# EAGLE design 20240311-sn76489-ver1 (EAGLE 9.6.2)
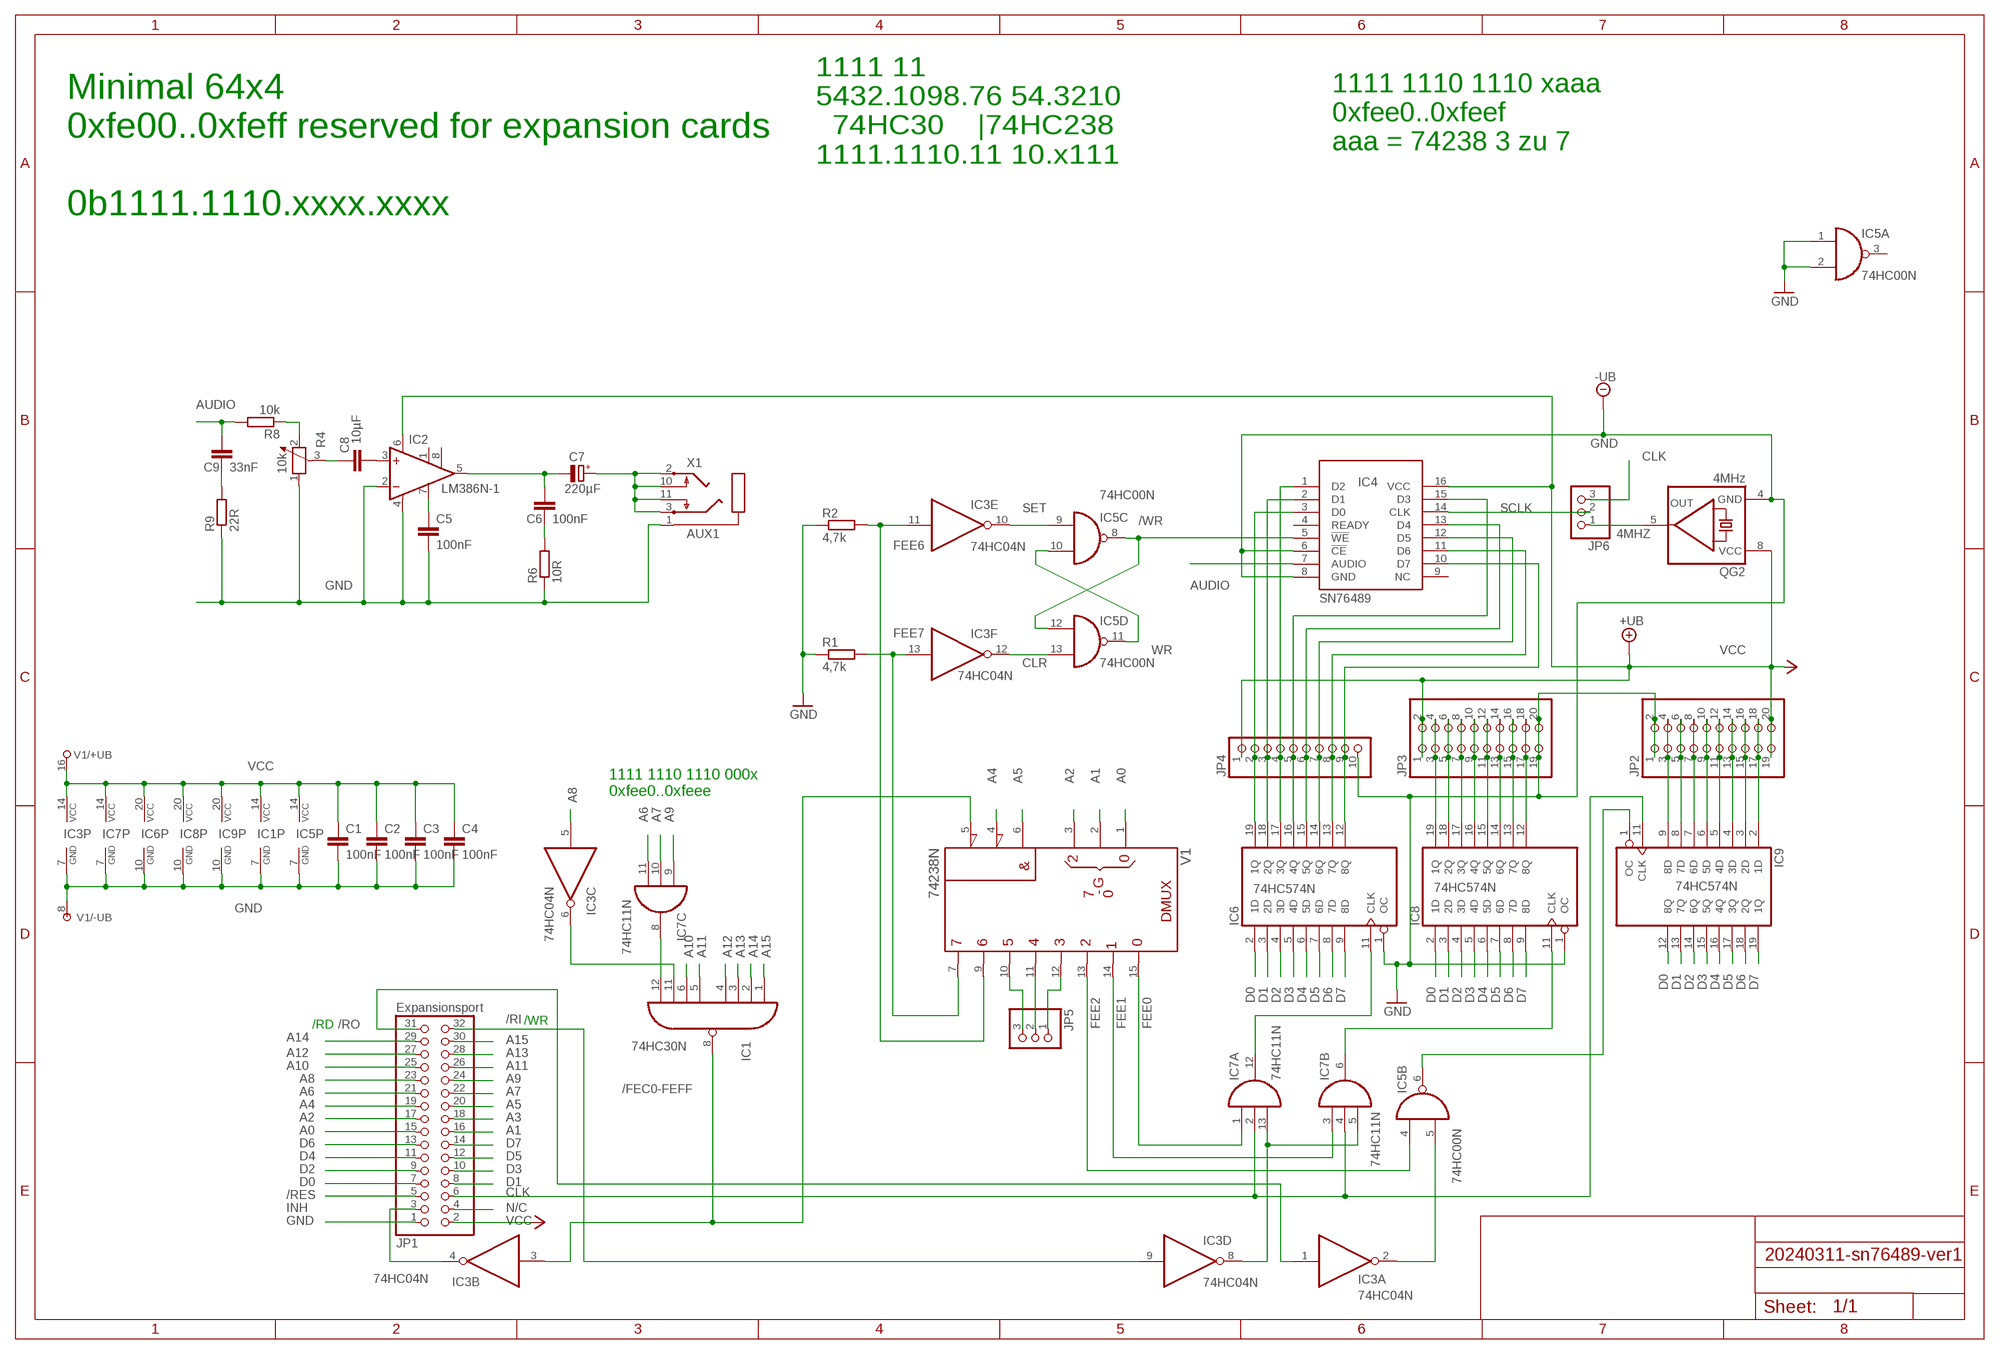
[diagram p0: schematic, sheet 1]

## Parts
C1  100nF  C-EU050-025X075  [C050-025X075]
C2  100nF  C-EU050-025X075  [C050-025X075]
C3  100nF  C-EU050-025X075  [C050-025X075]
C4  100nF  C-EU050-025X075  [C050-025X075]
C5  100nF  C-EU050-025X075  [C050-025X075]
C6  100nF  C-EU050-025X075  [C050-025X075]
C7  220µF  CPOL-EUE2.5-7  [E2,5-7]
C8  10µF  C-EU050-025X075  [C050-025X075]
C9  33nF  C-EU050-025X075  [C050-025X075]
IC1  74HC30N  [DIL14]
IC2  LM386N-1  [DIL08]
IC3  74HC04N  [DIL14]
IC4  SN76489  ALEX-PARTS_SN76489AN  [ALEX-PARTS_DIL16]
IC5  74HC00N  [DIL14]
IC6  74HC574N  [DIL20]
IC7  74HC11N  [DIL14]
IC8  74HC574N  [DIL20]
IC9  74HC574N  [DIL20]
JP1  Expansionsport  PINHD-2X16  [2X16]
JP2  PINHD-2X10  [2X10]
JP3  PINHD-2X10  [2X10]
JP4  PINHD-1X10  [1X10]
JP5  PINHD-1X3  [1X03]
JP6  PINHD-1X3  [1X03]
QG2  4MHz  QG5460  [DIL08S]
R1  4,7k  R-EU_0207/10  [0207/10]
R2  4,7k  R-EU_0207/10  [0207/10]
R4  10k  POTENTIOMETER_PT-10S  [PT-10S]
R6  10R  R-EU_0207/10  [0207/10]
R8  10k  R-EU_0207/10  [0207/10]
R9  22R  R-EU_0207/10  [0207/10]
V1  74238N  [DIL16]
X1  AUX1  CON-SJ1-352XNSJ1-352XN  [SJ1-352XN]

## Nets
4MHZ: JP6.1 QG2.5(OUT)
/FEC0-FEFF: IC1.8(O) IC3.3(B:I) V1.5(!G2B)
/RES: JP1.5
/RI: IC3.9(D:I) JP1.32
/RO: IC3.1(A:I) JP1.31
/WR: IC4.5(!WE) IC5.8(C:O) IC5.12(D:I0)
A0: JP1.15 V1.1(A)
A1: JP1.16 V1.2(B)
A2: JP1.17 V1.3(C)
A3: JP1.18
A4: JP1.19 V1.4(!G2A)
A5: JP1.20 V1.6(G1)
A6: IC7.11(C:I2) JP1.21
A7: IC7.10(C:I1) JP1.22
A8: IC3.5(C:I) JP1.23
A9: IC7.9(C:I0) JP1.24
A10: IC1.6(I5) JP1.25
A11: IC1.5(I4) JP1.26
A12: IC1.4(I3) JP1.27
A13: IC1.3(I2) JP1.28
A14: IC1.2(I1) JP1.29
A15: IC1.1(I0) JP1.30
AUDIO: C9.1 IC4.7(AUDIO) R8.2
AUXOUT: C7.+ X1.2 X1.3 X1.10 X1.11
CLK: IC7.2(A:I1) IC7.4(B:I1) IC9.11(CLK) JP1.6 JP6.3
CLR: IC3.12(F:O) IC5.13(D:I1)
D0: IC6.2(1D) IC8.2(1D) IC9.12(8Q) JP1.7
D1: IC6.3(2D) IC8.3(2D) IC9.13(7Q) JP1.8
D2: IC6.4(3D) IC8.4(3D) IC9.14(6Q) JP1.9
D3: IC6.5(4D) IC8.5(4D) IC9.15(5Q) JP1.10
D4: IC6.6(5D) IC8.6(5D) IC9.16(4Q) JP1.11
D5: IC6.7(6D) IC8.7(6D) IC9.17(3Q) JP1.12
D6: IC6.8(7D) IC8.8(7D) IC9.18(2Q) JP1.13
D7: IC6.9(8D) IC8.9(8D) IC9.19(1Q) JP1.14
FEE0: IC7.1(A:I0) V1.15(Y0)
FEE1: IC7.3(B:I0) V1.14(Y1)
FEE2: IC5.4(B:I0) V1.13(Y2)
FEE3: JP5.1 V1.12(Y3)
FEE4: JP5.2 V1.11(Y4)
FEE5: JP5.3 V1.10(Y5)
FEE6: IC3.11(E:I) R2.2 V1.9(Y6)
FEE7: IC3.13(F:I) R1.2 V1.7(Y7)
GND [Power]: C1.2 C2.2 C3.2 C4.2 C5.2 IC1.7(GND) IC2.2(-IN) IC2.4(GND) IC3.7(P:GND) IC4.6(!CE) IC4.8(GND) IC5.1(A:I0) IC5.2(A:I1) IC5.7(P:GND) IC6.1(OC) IC6.10(GND) IC7.7(P:GND) IC8.1(OC) IC8.10(GND) IC9.10(GND) JP1.1 JP2.1 JP2.2 JP3.19 JP3.20 JP4.10 QG2.4(GND) R1.1 R2.1 R4.1 R6.1 R9.1 V1.8(-UB) X1.1 ; supply symbol labelled -UB
IN0: IC9.9(8D) JP2.3 JP2.4
IN1: IC9.8(7D) JP2.5 JP2.6
IN2: IC9.7(6D) JP2.7 JP2.8
IN3: IC9.6(5D) JP2.9 JP2.10
IN4: IC9.5(4D) JP2.11 JP2.12
IN5: IC9.4(3D) JP2.13 JP2.14
IN6: IC9.3(2D) JP2.15 JP2.16
IN7: IC9.2(1D) JP2.17 JP2.18
INH: IC3.4(B:O) JP1.3
LM5: C6.1 C7.- IC2.5(OUT)
LM7: C5.1 IC2.7(BYPASS)
N$1: IC3.2(A:O) IC5.5(B:I1)
N$3: IC1.12(I7) IC7.8(C:O)
N$18: IC6.11(CLK) IC7.12(A:O)
N$19: IC1.11(I6) IC3.6(C:O)
N$20: IC3.8(D:O) IC7.5(B:I2) IC7.13(A:I2)
N$22: IC7.6(B:O) IC8.11(CLK)
N$24: IC5.6(B:O) IC9.1(OC)
N$45: C6.2 R6.2
N$46: C8.2 IC2.3(+IN)
N$47: C9.2 R9.2
N$49: R4.2 R8.1
N$50: C8.1 R4.3
N/C: JP1.4
OUT0: IC8.19(1Q) JP3.3 JP3.4
OUT1: IC8.18(2Q) JP3.5 JP3.6
OUT2: IC8.17(3Q) JP3.7 JP3.8
OUT3: IC8.16(4Q) JP3.9 JP3.10
OUT4: IC8.15(5Q) JP3.11 JP3.12
OUT5: IC8.14(6Q) JP3.13 JP3.14
OUT6: IC8.13(7Q) JP3.15 JP3.16
OUT7: IC8.12(8Q) JP3.17 JP3.18
SCLK: IC4.14(CLK) JP6.2
SET: IC3.10(E:O) IC5.9(C:I0)
SND0: IC4.3(D0) IC6.19(1Q) JP4.2
SND1: IC4.2(D1) IC6.18(2Q) JP4.3
SND2: IC4.1(D2) IC6.17(3Q) JP4.4
SND3: IC4.15(D3) IC6.16(4Q) JP4.5
SND4: IC4.13(D4) IC6.15(5Q) JP4.6
SND5: IC4.12(D5) IC6.14(6Q) JP4.7
SND6: IC4.11(D6) IC6.13(7Q) JP4.8
SND7: IC4.10(D7) IC6.12(8Q) JP4.9
VCC [Power]: C1.1 C2.1 C3.1 C4.1 IC1.14(VCC) IC2.6(VS) IC3.14(P:VCC) IC4.16(VCC) IC5.14(P:VCC) IC6.20(VCC) IC7.14(P:VCC) IC8.20(VCC) IC9.20(VCC) JP1.2 JP2.19 JP2.20 JP3.1 JP3.2 JP4.1 QG2.8(VCC) V1.16(+UB) ; supply symbol labelled +UB
WR: IC5.10(C:I1) IC5.11(D:O)
Unconnected: IC2.1(GAIN) IC2.8(GAIN) IC4.4(READY) IC4.9(NC) IC5.3(A:O)

## Notes on the sheet
- 1111 1110 1110 xaaa
  0xfee0..0xfeef
  aaa = 74238 3 zu 7
- 1111 11
  5432.1098.76 54.3210
    74HC30    |74HC238
  1111.1110.11 10.x111
- Minimal 64x4
  0xfe00..0xfeff reserved for expansion cards
  
  0b1111.1110.xxxx.xxxx
- 1111 1110 1110 000x
  0xfee0..0xfeee
- /WR
- /RD

## Library data of the parts
C1-C6 C8 C9 = rcl:C-EU: CAPACITOR, European symbol; SPICEPREFIX: C
C7 = rcl:CPOL-EU: POLARIZED CAPACITOR, European symbol; SPICEPREFIX: C
IC1 = 74xx-eu:74*30: 8-input NAND gate
IC2 = linear:LM386?-*: Low Voltage Audio Power Amplifier Source: http://cache.national.com/ds/LM/LM386.pdf
IC3 = 74xx-eu:74*04: Hex INVERTER
IC4 = squareinator2:ALEX-PARTS_SN76489AN: TI SN76489AN Sound Generator
IC5 = 74xx-eu:74*00: Quad 2-input NAND gate
IC6 IC8 IC9 = 74xx-eu:74*574: 8-bit D type FLIP FLOP bus driver
IC7 = 74xx-eu:74*11: Triple 3-input AND gate
JP1 = pinhead:PINHD-2X16: PIN HEADER
JP2 JP3 = pinhead:PINHD-2X10: PIN HEADER
JP4 = pinhead:PINHD-1X10: PIN HEADER
JP5 JP6 = pinhead:PINHD-1X3: PIN HEADER
QG2 = crystal:QG5460: CRYSTAL RESONATOR; OC_FARNELL: unknown; OC_NEWARK: unknown
R1 R2 R6 R8 R9 = rcl:R-EU_: RESISTOR, European symbol; SPICEPREFIX: R
R4 = rcl:POTENTIOMETER_: Potentiometer; SPICEMODEL: POT; SPICEPREFIX: X
V1 = 74ttl-din:74*238: 1 of 8 noninverting DECODER/DEMULTIPLEXER
X1 = con-sj1-352xn:CON-SJ1-352XN: MIC/HEADPHONE JACK KS-S stereo microphone/headphone jack SJ1-352XN (CUD Devices)

## Net classes
0 default: width 0.254 mm
1 Power: width 0.457 mm

## Board
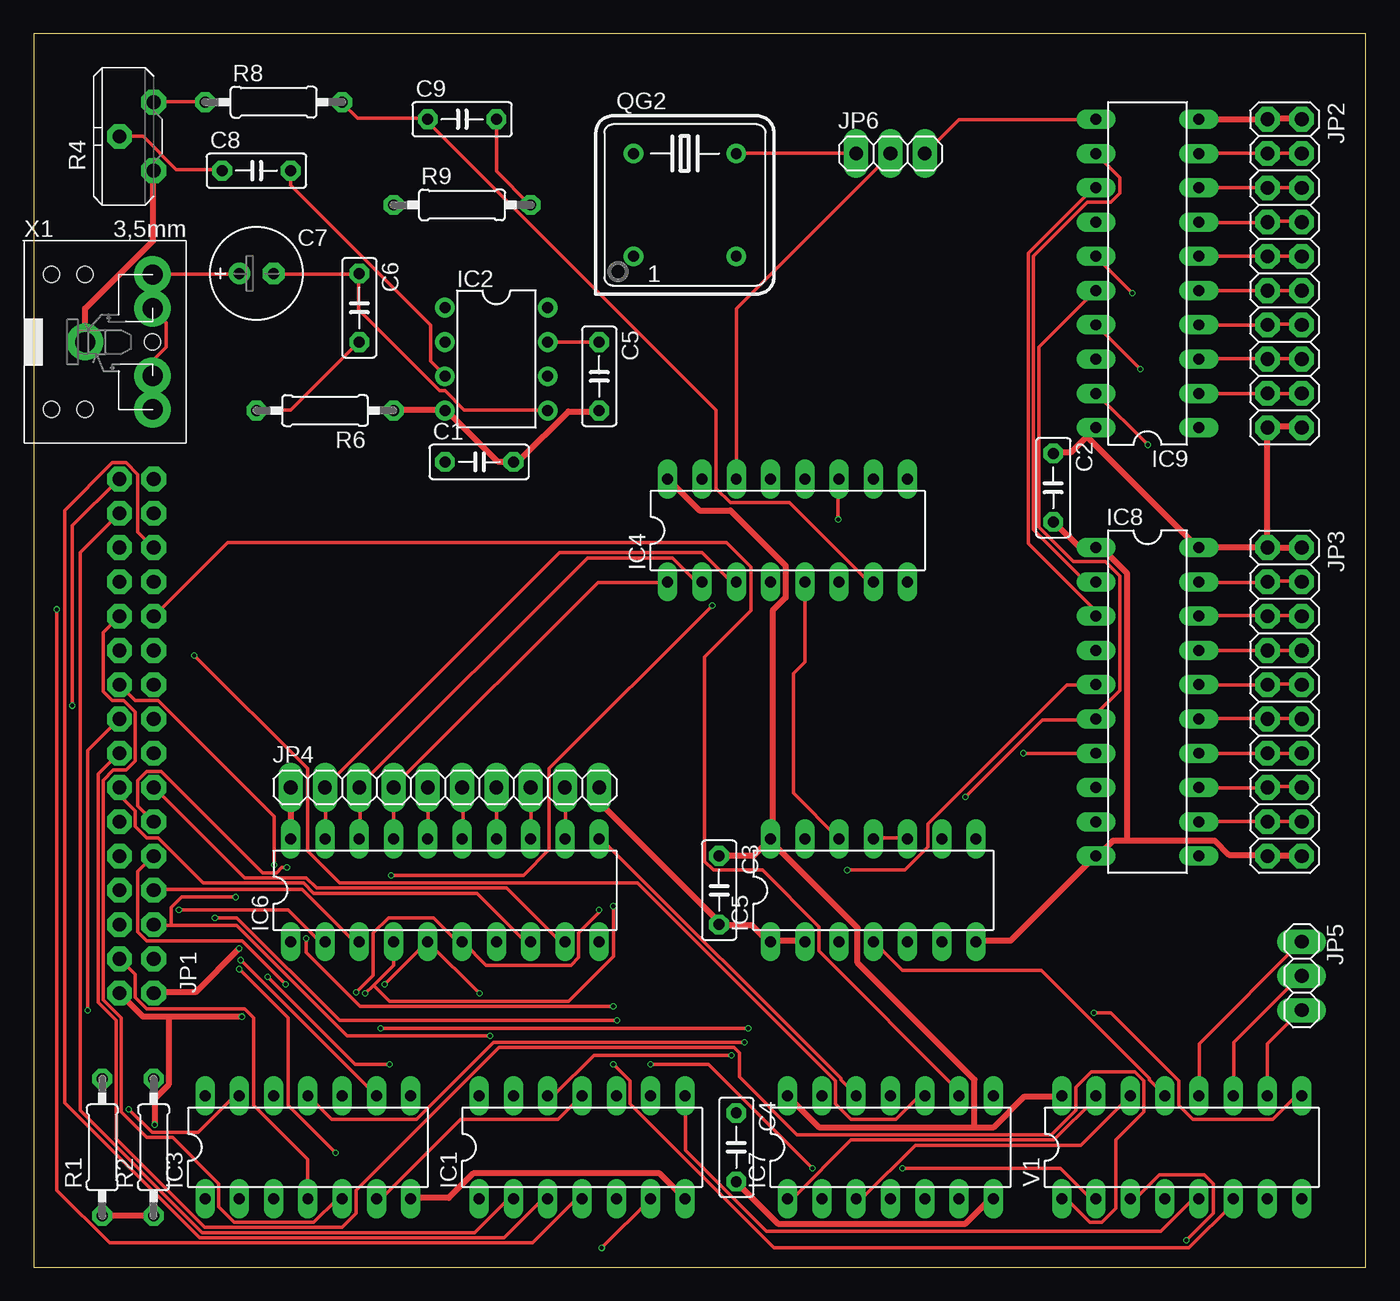
[diagram p1: board, top side]
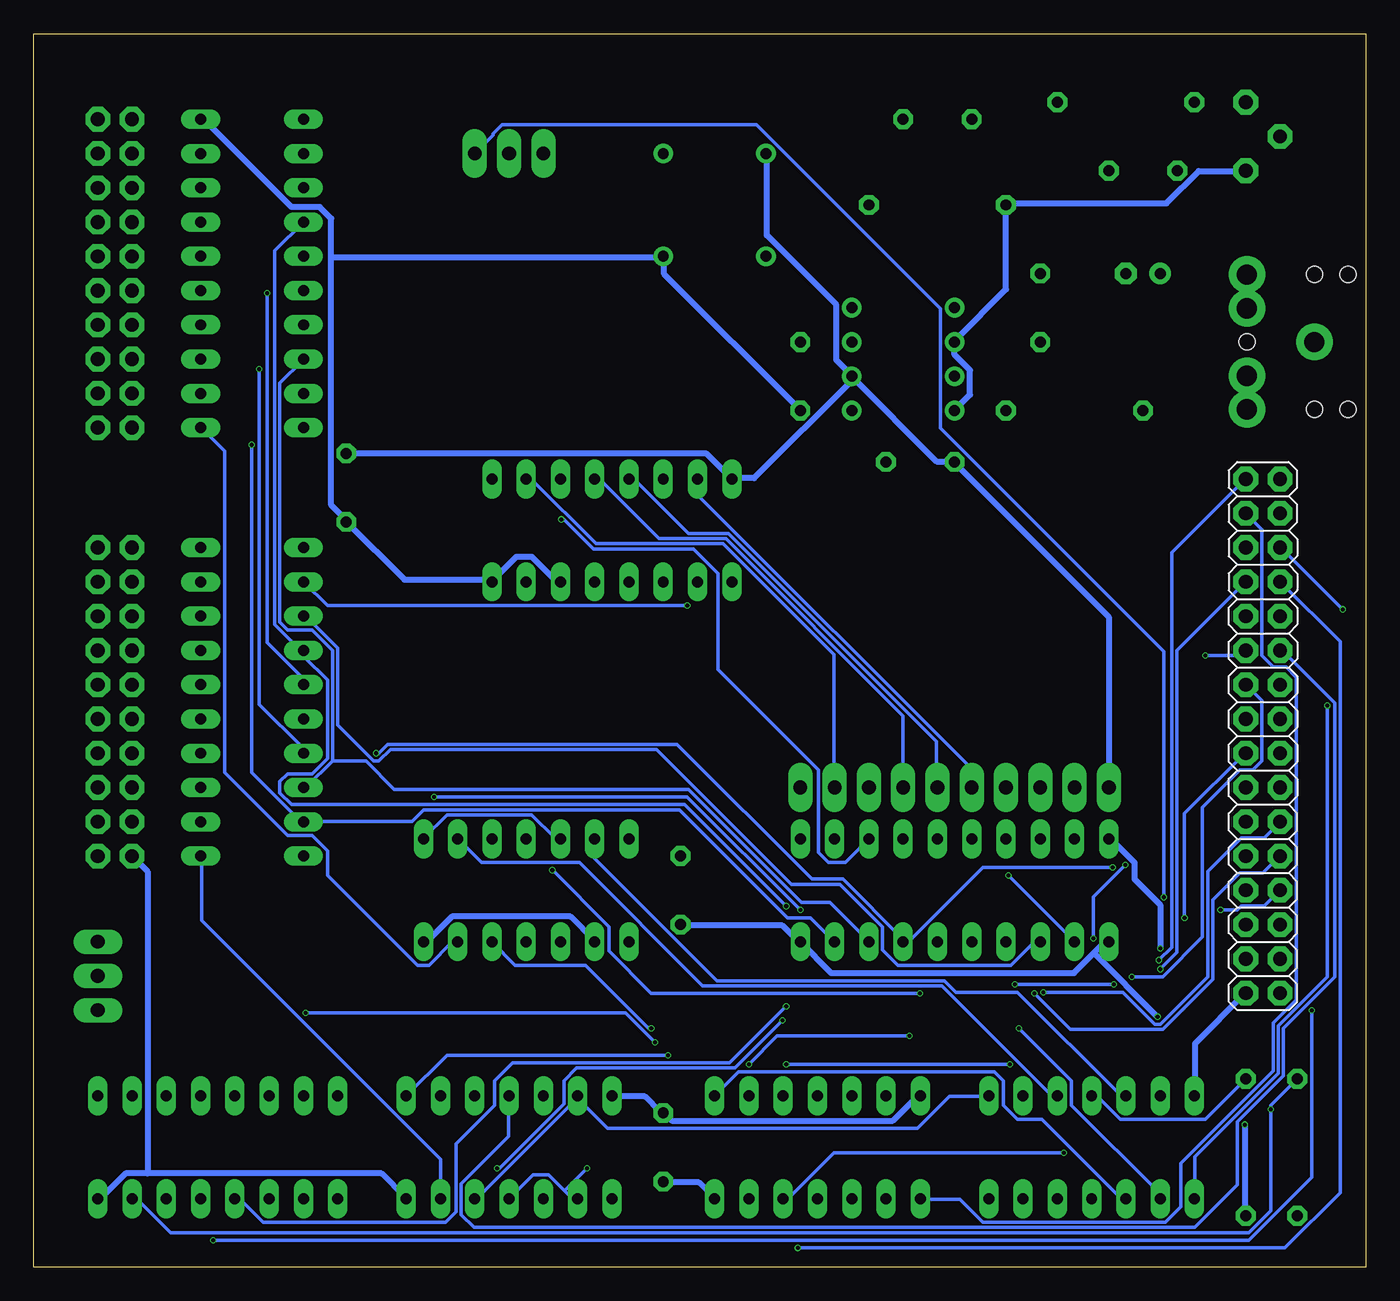
[diagram p2: board, bottom side, seen from below]

Size 98.73 x 91.43 mm. Coordinates in mm from the lower left corner, seen from the top.
Outline: 0,0 98.73,0 98.73,91.43 0,91.43 0,0
Copper layers (1*16): Top 0.035mm / dielectric 1.6mm / Bottom 0.035mm
Design rules "jlcpcb-2layers": minimum track width 5mil, minimum drill 0.3mm, track to track 5mil, track to pad 5mil, pad to pad 5mil, via to via 5mil, smd to smd 5mil, copper to edge 0.2mm, drill to drill 6mil, minimum pad ring 10mil, minimum via ring 3mil, stop-mask expansion 4mil, vias tented up to drill 0mil, thermal gap 10mil

### Footprints (pad centres in the part's own frame; a part is rotated, then mirrored left to right if it is on the bottom)
C050-025X075 = drill 0.813 octagon: 1 -2.54,0; 2 2.54,0
E2,5-7 = drill 0.813 pad 1.6: + -1.27,0 | drill 0.813 pad 1.6 octagon: - 1.27,0
DIL14 = drill 0.813 long: 1 -7.62,-3.81; 2 -5.08,-3.81; 3 -2.54,-3.81; 4 0,-3.81; 5 2.54,-3.81; 6 5.08,-3.81; 7 7.62,-3.81; 8 7.62,3.81; 9 5.08,3.81; 10 2.54,3.81; 11 0,3.81; 12 -2.54,3.81; 13 -5.08,3.81; 14 -7.62,3.81
DIL08 = drill 0.813 pad 1.27: 1 -3.81,-3.81; 2 -1.27,-3.81; 3 1.27,-3.81; 4 3.81,-3.81; 5 3.81,3.81; 6 1.27,3.81; 7 -1.27,3.81; 8 -3.81,3.81
ALEX-PARTS_DIL16 = drill 0.813 long: 1 -8.89,-3.81; 2 -6.35,-3.81; 3 -3.81,-3.81; 4 -1.27,-3.81; 5 1.27,-3.81; 6 3.81,-3.81; 7 6.35,-3.81; 8 8.89,-3.81; 9 8.89,3.81; 10 6.35,3.81; 11 3.81,3.81; 12 1.27,3.81; 13 -1.27,3.81; 14 -3.81,3.81; 15 -6.35,3.81; 16 -8.89,3.81
DIL20 = drill 0.813 long: 1 -11.43,-3.81; 2 -8.89,-3.81; 3 -6.35,-3.81; 4 -3.81,-3.81; 5 -1.27,-3.81; 6 1.27,-3.81; 7 3.81,-3.81; 8 6.35,-3.81; 9 8.89,-3.81; 10 11.43,-3.81; 11 11.43,3.81; 12 8.89,3.81; 13 6.35,3.81; 14 3.81,3.81; 15 1.27,3.81; 16 -1.27,3.81; 17 -3.81,3.81; 18 -6.35,3.81; 19 -8.89,3.81; 20 -11.43,3.81
2X16 = drill 1.016 octagon: 1 -19.05,-1.27; 2 -19.05,1.27; 3 -16.51,-1.27; 4 -16.51,1.27; 5 -13.97,-1.27; 6 -13.97,1.27; 7 -11.43,-1.27; 8 -11.43,1.27; 9 -8.89,-1.27; 10 -8.89,1.27; 11 -6.35,-1.27; 12 -6.35,1.27; 13 -3.81,-1.27; 14 -3.81,1.27; 15 -1.27,-1.27; 16 -1.27,1.27; 17 1.27,-1.27; 18 1.27,1.27; 19 3.81,-1.27; 20 3.81,1.27; 21 6.35,-1.27; 22 6.35,1.27; 23 8.89,-1.27; 24 8.89,1.27; 25 11.43,-1.27; 26 11.43,1.27; 27 13.97,-1.27; 28 13.97,1.27; 29 16.51,-1.27; 30 16.51,1.27; 31 19.05,-1.27; 32 19.05,1.27
2X10 = drill 1.016 octagon: 1 -11.43,-1.27; 2 -11.43,1.27; 3 -8.89,-1.27; 4 -8.89,1.27; 5 -6.35,-1.27; 6 -6.35,1.27; 7 -3.81,-1.27; 8 -3.81,1.27; 9 -1.27,-1.27; 10 -1.27,1.27; 11 1.27,-1.27; 12 1.27,1.27; 13 3.81,-1.27; 14 3.81,1.27; 15 6.35,-1.27; 16 6.35,1.27; 17 8.89,-1.27; 18 8.89,1.27; 19 11.43,-1.27; 20 11.43,1.27
1X10 = drill 1.016 long: 1 -11.43,0; 2 -8.89,0; 3 -6.35,0; 4 -3.81,0; 5 -1.27,0; 6 1.27,0; 7 3.81,0; 8 6.35,0; 9 8.89,0; 10 11.43,0
1X03 = drill 1.016 long: 1 -2.54,0; 2 0,0; 3 2.54,0
DIL08S = drill 0.813: 1 -3.81,-3.81; 4 3.81,-3.81; 5 3.81,3.81; 8 -3.81,3.81
0207/10 = drill 0.813 octagon: 1 -5.08,0; 2 5.08,0
PT-10S = drill 1.016 pad 1.778 octagon: 1 -2.54,-1.27; 2 2.54,-1.27; 3 0,1.27
DIL16 = drill 0.813 long: 1 -8.89,-3.81; 2 -6.35,-3.81; 3 -3.81,-3.81; 4 -1.27,-3.81; 5 1.27,-3.81; 6 3.81,-3.81; 7 6.35,-3.81; 8 8.89,-3.81; 9 8.89,3.81; 10 6.35,3.81; 11 3.81,3.81; 12 1.27,3.81; 13 -1.27,3.81; 14 -3.81,3.81; 15 -6.35,3.81; 16 -8.89,3.81
SJ1-352XN = drill 1.5 pad 2.184: 1 0,0; 2 5,-5; 3 5,5; 10 5,-2.5; 11 5,2.5 | hole 1.2: 5,0; 0,5; 0,-5; -2.5,-5; -2.5,5

### Placement (x,y rotation side)
C1  33.02,59.69 0 top
C2  75.56,57.78 270 top
C3  50.8,27.94 270 top
C4  52.07,8.89 270 top
C5  41.91,66.04 270 top
C6  24.13,71.12 270 top
C7  16.51,73.66 0 top
C8  16.51,81.28 0 top
C9  31.75,85.09 0 top
IC1  40.64,8.89 0 top
IC2  34.29,67.31 270 top
IC3  20.32,8.89 0 top
IC4  55.88,54.61 0 top
IC5  62.23,27.94 0 top
IC6  30.48,27.94 0 top
IC7  63.5,8.89 0 top
IC8  82.55,41.91 270 top
IC9  82.55,73.66 90 top
JP1  7.62,39.37 90 bottom
JP2  92.71,73.66 270 top
JP3  92.71,41.91 270 top
JP4  30.48,35.56 0 top
JP5  93.98,21.59 270 top
JP6  63.5,82.55 0 top
QG2  48.26,78.74 0 top
R1  5.08,8.89 90 top
R2  8.89,8.89 90 top
R4  7.62,83.82 90 top
R6  21.59,63.5 180 top
R8  17.78,86.36 0 top
R9  31.75,78.74 0 top
V1  85.09,8.89 0 top
X1  3.81,68.58 0 top

### Tracks (layer width: path | path; a pad name or v marks a point on that pad's centre or on a via)
4MHZ
  Top 0.254: QG2.5 52.1,82.58 60.96,82.58 JP6.1
/FEC0-FEFF
  Top 0.254: V1.5 86.3,5.05 85.92,5.05 83.53,2.67 54.29,2.67 48.29,8.67 48.29,12.67 IC1.8
  Bottom 0.254: IC1.8 46.48,14.48 27.53,14.48 26.86,13.81 26.86,12 25.81,10.95 24,10.95 18.19,5.14 17.81,5.14 IC3.3
/RI  (via drill 0.3)
  Top 0.254: v15.34,22.77 IC3.9
  Bottom 0.254: v15.34,22.77 14.38,23.72 14.38,52.96 8.95,58.39 JP1.32
/RO  (via drill 0.3)
  Top 0.254: v2.86,41.62 2.86,54.96 6.29,58.39 JP1.31
  Bottom 0.254: v2.86,41.62 2.86,21.53 6.48,17.91 6.48,14.38 12.67,8.19 12.67,5.14 IC3.1
/WR
  Top 0.254: IC4.5 57.15,44.86 56.29,44.01 56.29,35.15 IC5.12
  Bottom 0.254: IC5.12 59.72,31.81 60.1,31.81 61.82,33.53 68.1,33.53 69.82,31.81 IC5.8
A0
  Top 0.254: V1.1 76.2,5.05 76.58,5.05 78.3,3.33 79.15,3.33 80.2,4.38 80.2,9.43 82.3,11.53 82.3,13.81 81.63,14.48 78.39,14.48 77.25,13.34 77.25,11.62 75.44,9.81 56.58,9.81 52.29,14.1 52.29,15.91 51.91,16.29 34.48,16.29 23.91,5.71 23.91,4 22.86,2.95 12.67,2.95 6.1,9.53 6.1,18.29 4.76,19.62 4.76,36.58 6.29,38.1 JP1.15
A1  (via drill 0.3)
  Top 0.254: v64.39,7.33 76.11,7.33 78.3,5.14 78.68,5.14 V1.2 | v43.24,18.29 22.67,18.29 15.05,25.91 v13.43,25.91
  Bottom 0.254: v64.39,7.33 64.2,7.33 59.44,12.1 59.44,13.81 58.48,14.76 46.77,14.76 v43.24,18.29 | v13.43,25.91 13.43,33.62 8.95,38.1 JP1.16
A2  (via drill 0.3)
  Top 0.254: v85.44,2 87.44,4 87.44,6.19 86.77,6.86 83.44,6.86 81.72,5.14 81.34,5.14 V1.3 | v4,19.05 4,38.29 JP1.17
  Bottom 0.254: v85.44,2 8.67,2 4,6.67 v4,19.05
A4  (via drill 0.3)
  Top 0.254: v42.96,19.34 24.19,19.34 20.19,23.34 v20.19,24.38 | v17.81,29.81 17.81,33.43 9.24,42.01 7.53,42.01 JP1.19
  Bottom 0.254: v42.96,19.34 47.15,15.14 63.25,15.14 64.58,13.81 64.58,12 67.44,9.14 67.44,4.1 68.2,3.33 81.72,3.33 83.44,5.05 83.82,5.05 V1.4 | v20.19,24.38 20.19,27.43 v17.81,29.81
A5  (via drill 0.3)
  Top 0.254: v42.96,15.05 44.2,13.81 44.2,12.1 54.86,1.43 85.63,1.43 88.87,4.67 88.87,5.05 V1.6 | v26.38,15.05 23.81,15.05 v17.34,21.53
  Bottom 0.254: v26.38,15.05 v42.96,15.05 | v17.34,21.53 15.05,21.53 12.1,24.48 12.1,34.1 9.34,36.86 8.38,36.86 7.71,37.53 7.71,42.01 JP1.20
A6
  Bottom 0.254: JP1.21 6.19,45.72 2.29,41.81 2.29,21.53 6.1,17.72 6.1,14.19 9.53,10.76 9.53,6.1 12.67,2.95 66.1,2.95 67.06,3.9 67.06,6.19 63.53,9.72 63.53,12.67 IC7.11
A7  (via drill 0.3)
  Top 0.254: v11.91,45.34 20.29,36.96 20.29,30.86 22.67,28.48 44.77,28.48 59.44,13.81 59.44,12.1 60.58,10.95 63.91,10.95 65.63,12.67 66.01,12.67 IC7.10
  Bottom 0.254: v11.91,45.34 9.34,45.34 8.95,45.72 JP1.22
A8
  Top 0.254: JP1.23 5.14,47.05 5.14,42.67 5.81,42.01 6.67,42.01 7.53,41.15 7.53,37.53 6.86,36.86 5.91,36.86 5.14,36.1 5.14,19.81 6.48,18.48 6.48,11.53 8.38,9.62 10.29,9.62 13.72,6.19 13.72,4.48 14.86,3.33 20.77,3.33 22.48,5.05 22.86,5.05 IC3.5
A9
  Top 0.254: IC7.9 68.58,13.05 58.2,23.43 58.2,25.24 54.01,29.43 50.39,29.43 49.72,30.1 49.72,45.24 53.15,48.67 53.15,51.91 51.34,53.72 14.38,53.72 8.95,48.29 JP1.24
A10  (via drill 0.3)
  Top 0.254: v42.1,1.43 45.72,5.05 IC1.6
  Bottom 0.254: v42.1,1.43 6,1.43 1.91,5.52 1.91,46.39 6.29,50.77 JP1.25
A11  (via drill 0.3)
  Top 0.254: v22.38,8.48 18.86,12 18.86,18.48 v15.24,22.1
  Bottom 0.254: v22.38,8.48 39.43,8.48 42.77,5.14 43.15,5.14 IC1.5 | v15.24,22.1 14,23.34 14,45.72 8.95,50.77 JP1.26
A12  (via drill 0.3)
  Top 0.254: v1.71,48.77 1.71,5.71 5.62,1.81 36.96,1.81 40.2,5.05 40.58,5.05 IC1.4
  Bottom 0.254: v1.71,48.77 6.29,53.34 JP1.27
A13
  Top 0.254: IC1.3 38.1,5.05 37.72,5.05 34.86,2.19 12.29,2.19 2.29,12.19 2.29,56.1 5.81,59.63 6.86,59.63 7.71,58.77 7.71,54.48 8.86,53.34 JP1.28
A14
  Top 0.254: JP1.29 3.43,52.96 3.43,11.62 12.48,2.57 32.67,2.57 35.15,5.05 35.53,5.05 IC1.2
A15
  Bottom 0.254: IC1.1 32.96,5.05 30.1,5.05 28.38,3.33 14.86,3.33 13.72,4.48 13.72,7.71 6.86,14.57 6.86,18.1 5.14,19.81 5.14,43.72 5.91,44.48 6.86,44.48 7.71,45.34 7.71,54.67 8.86,55.82 JP1.30
AUDIO
  Top 0.254: R8.2 22.86,86.3 24,85.15 29.15,85.15 C9.1 29.05,85.06 50.58,63.53 50.58,57.72 51.63,56.67 56.01,56.67 61.82,50.86 62.2,50.86 IC4.7
AUXOUT
  Top 0.254: X1.2 8.86,63.63 8.86,66.01 X1.10 8.86,66.2 8.86,67.25 9.81,68.2 9.81,70.01 8.86,70.96 X1.11 8.86,71.15 8.86,73.53 X1.3 8.86,73.63 15.24,73.63 C7.+
CLK  (via drill 0.3)
  Top 0.254: IC9.11 78.68,85.06 68.58,85.06 66.1,82.58 JP6.3 | 10.19,25.34 15.05,25.34 23.24,17.14 v33.81,17.14 | 10.19,25.34 8.95,25.34 JP1.6 | v45.72,15.05 50.01,15.05 v57.72,7.33 | v14.95,27.43 10.95,27.43 10.19,26.67 10.19,25.34
  Bottom 0.254: 59.39,5.67 60.58,6.86 61.72,6.86 IC7.4 | 59.39,5.67 58.86,5.14 58.48,5.14 IC7.2 | v33.81,17.14 43.62,17.14 v45.72,15.05 | 59.39,5.67 v57.72,7.33 | JP6.3 64.67,83.92 64.67,84.01 64.01,84.68 45.15,84.68 31.53,71.06 31.53,62.2 14.95,45.62 v14.95,27.43
CLR
  Bottom 0.254: IC5.13 57.15,30.29 48.1,21.24 31.24,21.24 30.39,20.38 25.81,20.38 18.19,12.76 17.81,12.76 IC3.12
D0  (via drill 0.3)
  Top 0.254: v10.76,26.48 18.86,26.48 21.14,24.19 21.53,24.19 IC6.2 | IC8.2 78.68,50.86 77.92,50.86 74.11,54.67 74.11,74.96 78.11,78.96 79.82,78.96 80.49,79.63 80.49,80.77 78.77,82.49 IC9.12 | v26.48,29.05 36.29,29.05 38.2,30.96 38.2,36.96 v50.29,49.05
  Bottom 0.254: v10.76,26.48 9.53,26.48 9.24,26.77 7.53,26.77 JP1.7 | v26.48,29.05 21.62,24.19 IC6.2 | v50.29,49.05 76.96,49.05 78.68,50.77 IC8.2
D1
  Top 0.254: IC6.3 24.1,24.19 23.72,24.19 19.91,28 8.95,28 JP1.8 | IC9.13 78.58,80.01 73.72,75.15 73.72,53.63 78.68,48.67 78.68,48.29 IC8.3
  Bottom 0.254: IC6.3 24.19,24.1 24.57,24.1 26.29,22.38 34.67,22.38 35.81,23.53 35.81,25.24 38.96,28.38 42.58,28.38 52.58,38.39 72.3,38.39 73.15,37.53 73.53,37.53 76.2,40.2 76.2,45.91 78.49,48.2 78.68,48.2 IC8.3
D2  (via drill 0.3)
  Top 0.254: IC6.4 26.67,22.38 25.19,20.91 | v24.57,20.29 25.19,20.91 | v42.96,26.77 42.96,23.05 39.62,19.72 26.38,19.72 25.19,20.91
  Bottom 0.254: IC9.14 80.87,75.34 80.87,47.62 78.96,45.72 IC8.4 78.68,45.62 78.68,45.24 76.96,43.53 76.96,37.72 78.11,36.58 79.92,36.58 80.49,36.01 80.49,35.15 79.63,34.29 50.48,34.29 v42.96,26.77 | v24.57,20.29 21.91,17.62 15.05,17.62 11.34,21.34 11.34,27.24 9.34,29.24 7.62,29.24 6.38,30.48 JP1.9
D3  (via drill 0.3)
  Top 0.254: v26,20.95 29.15,24.1 IC6.5 v33.05,20.29 | v18.67,20.95 15.43,24.19 8.38,24.19 7.71,24.86 7.71,29.34 8.86,30.48 JP1.10 | v81.44,72.2 78.77,74.87 IC9.15 | v60.29,29.43 64.58,29.43 66.29,31.15 66.29,32.86 76.58,43.15 78.68,43.15 IC8.5
  Bottom 0.254: v18.67,20.95 v26,20.95 | v81.44,72.2 81.44,46.29 78.77,43.62 78.77,43.24 IC8.5 | v33.05,20.29 52.96,20.29 56.1,23.43 56.1,25.24 v60.29,29.43
D4  (via drill 0.3)
  Top 0.254: IC9.16 78.68,72.39 74.49,68.2 74.49,54.86 77.06,52.29 79.44,52.29 80.49,51.24 80.49,42.77 78.77,41.05 78.77,40.67 IC8.6 78.68,40.58 74.77,40.58 v69.06,34.86 | v23.91,20.38 25.15,21.62 25.15,24.77 26.29,25.91 29.62,25.91 31.34,24.19 31.72,24.19 IC6.6 31.81,24.1 33.53,22.38 39.81,22.38 40.39,22.95 40.39,24.77 41.91,26.29 v41.91,26.48
  Bottom 0.254: v23.91,20.38 18,20.38 15.62,18 15.24,18 11.72,21.53 11.72,29.34 9.24,31.81 7.53,31.81 6.38,32.96 JP1.11 | v69.06,34.86 50.29,34.86 v41.91,26.48
D5  (via drill 0.3)
  Top 0.254: IC9.17 v82.01,66.58 | v18.76,29.62 18.38,29.62 18,29.24 16.95,29.24 9.43,36.77 8.38,36.77 7.71,36.1 7.71,34.2 JP1.12 | v73.34,38.1 IC8.7
  Bottom 0.254: v82.01,66.58 82.01,41.72 78.77,38.48 78.77,38.1 IC8.7 | v18.76,29.62 28.38,29.62 33.81,24.19 34.29,24.19 IC6.7 34.29,24.29 38.77,28.77 41.05,28.77 51.05,38.77 72.48,38.77 73.15,38.1 v73.34,38.1
D6
  Top 0.254: IC6.8 36.77,24.19 36.39,24.19 32.86,27.72 20.77,27.72 20,28.48 12.57,28.48 9.24,31.81 8.38,31.81 7.53,32.67 7.53,33.81 6.38,34.96 6.38,35.53 JP1.13
  Bottom 0.254: 76.58,37.53 78.49,35.62 78.68,35.62 IC8.8 | 76.58,37.53 76.58,45.72 78.11,47.24 79.92,47.24 80.49,47.82 80.49,65.53 78.77,67.25 IC9.18 | 76.58,37.53 74.11,37.53 72.01,35.43 50.2,35.43 41.81,27.05 39.72,27.05 36.86,24.19 IC6.8
D7  (via drill 0.3)
  Top 0.254: IC6.9 39.34,24.19 38.96,24.19 35.05,28.1 20.95,28.1 20.19,28.86 15.62,28.86 8.95,35.53 JP1.14 | v82.58,60.96 78.77,64.77 IC9.19
  Bottom 0.254: IC6.9 41.15,25.91 42.86,25.91 50.86,33.91 69.82,33.91 70.67,33.05 78.68,33.05 IC8.9 78.77,33.05 78.96,33.05 82.58,36.67 v82.58,60.96
FEE0
  Top 0.254: IC7.1 55.91,5.14 56.29,5.14 60.58,9.43 75.63,9.43 78.68,12.48 78.68,12.67 V1.15
FEE1
  Top 0.254: V1.14 77.63,9.05 65.34,9.05 61.44,5.14 60.96,5.14 IC7.3
FEE2
  Top 0.254: V1.13 83.82,12.76 82.68,13.91 82.68,14 74.68,22 64.39,22 62.29,24.1 IC5.4
FEE3
  Top 0.254: V1.12 86.39,12.76 86.39,16.57 93.92,24.1 JP5.1
FEE4
  Top 0.254: V1.11 88.96,12.76 88.96,16.67 93.92,21.62 JP5.2
FEE5
  Top 0.254: V1.10 91.44,16.57 93.92,19.05 JP5.3
FEE6  (via drill 0.3)
  Top 0.254: v78.58,18.86 79.82,18.86 84.87,13.81 84.87,12 85.92,10.95 91.82,10.95 93.53,12.67 93.92,12.67 V1.9 | v52.67,16.67 34.1,16.67 28.38,10.95 22.1,10.95 20.38,12.67 IC3.11
  Bottom 0.254: R2.2 11.91,10.95 18.19,10.95 19.91,12.67 20.29,12.67 IC3.11 | v78.58,18.86 54.86,18.86 v52.67,16.67
FEE7  (via drill 0.3)
  Top 0.254: v7.05,11.72 8.76,10 12.19,10 14.86,12.67 15.24,12.67 IC3.13
  Bottom 0.254: R1.2 7.05,12 v7.05,11.72 7.05,4.19 8.67,2.57 88.58,2.57 91.06,5.05 91.44,5.05 V1.7
GND  (via drill 0.3)
  Top 0.457: X1.1 3.81,71.06 8.86,76.11 8.86,81.25 R4.1 | R6.1 26.67,63.53 30.48,63.53 IC2.4 30.67,63.44 34.38,59.72 35.53,59.72 C1.2 35.72,59.82 36.01,59.82 39.62,63.44 41.91,63.44 C5.2 | IC9.10 86.39,85.06 91.44,85.06 JP2.1 91.63,85.15 93.92,85.15 JP2.2 | C2.2 75.63,55.24 77.53,53.34 IC8.1 78.96,53.24 79.25,53.24 81.06,51.44 81.06,31.62 | IC1.7 46.39,6.95 32.58,6.95 30.77,5.14 28,5.14 IC3.7 | IC7.7 71.06,5.05 70.87,5.05 69.06,3.24 55.15,3.24 52.1,6.29 C4.2 | JP3.20 JP3.19 91.25,30.57 88.58,30.57 87.53,31.62 81.06,31.62 | IC5.7 69.91,24.19 72.39,24.19 78.68,30.48 IC8.10 78.96,30.57 80.01,31.62 81.06,31.62 | IC5.2 57.15,24.19 54.67,24.19 IC5.1 54.39,24.19 53.24,25.34 50.86,25.34 C3.2 50.77,25.62 41.91,34.48 JP4.10 | R2.1 R1.1 | JP1.1 8.1,18.57 10,18.57 | v15.43,18.57 10,18.57 | v8.95,10.57 8.95,12.48 10,13.53 10,18.57
  Bottom 0.457: IC2.4 30.48,63.53 29.34,64.67 29.34,66.48 30.48,67.63 IC2.2 30.39,68.77 26.67,72.48 R9.1 26.48,78.87 14.76,78.87 12.38,81.25 8.95,81.25 R4.1 | C5.2 41.91,63.53 52.01,73.63 52.01,74.87 QG2.4 52.29,74.87 76.68,74.87 | IC4.6 59.72,50.86 60.01,50.86 61.82,52.67 62.96,52.67 64.77,50.86 IC4.8 64.96,50.96 71.25,50.96 75.53,55.24 C2.2 75.63,55.44 76.68,56.48 76.68,74.87 | 76.68,74.87 76.68,77.72 77.53,78.58 79.63,78.58 86.11,85.06 86.3,85.06 IC9.10 | C4.2 52.01,6.29 49.44,6.29 48.29,5.14 IC1.7 | 90.3,6.95 72.96,6.95 71.15,5.14 IC7.7 | 90.3,6.95 91.92,6.95 93.73,5.14 93.92,5.14 V1.8 | 20.14,23.29 21.62,21.81 39.62,21.81 41.91,24.1 IC6.10 42.1,24.19 43.24,25.34 50.77,25.34 C3.2 | 20.14,23.29 19.34,24.1 19.05,24.1 IC6.1 | 20.14,23.29 v15.43,18.57 | v8.95,10.57 8.95,3.81 R2.1 | IC5.7 69.82,24.19 69.53,24.19 67.72,26 58.96,26 57.15,24.19 IC5.2 | 90.3,6.95 90.3,29.34 JP3.19
IN0
  Top 0.254: IC9.9 86.39,82.58 91.44,82.58 JP2.3 91.53,82.58 93.92,82.58 JP2.4
IN1
  Top 0.254: IC9.8 JP2.5 JP2.6
IN2
  Top 0.254: IC9.7 86.39,77.44 91.44,77.44 JP2.7 91.53,77.53 93.92,77.53 JP2.8
IN3
  Top 0.254: IC9.6 86.39,74.96 91.44,74.96 JP2.9 91.53,74.96 93.92,74.96 JP2.10
IN4
  Top 0.254: IC9.5 JP2.11 JP2.12
IN5
  Top 0.254: IC9.4 86.39,69.82 91.44,69.82 JP2.13 91.53,69.91 93.92,69.91 JP2.14
IN6
  Top 0.254: IC9.3 86.39,67.34 91.44,67.34 JP2.15 91.53,67.34 93.92,67.34 JP2.16
IN7
  Top 0.254: IC9.2 JP2.17 JP2.18
INH
  Top 0.254: IC3.4 20.29,5.14 20.29,8 16.29,12 16.29,18.48 15.62,19.14 8.38,19.14 7.53,20 7.53,21.72 6.38,22.86 JP1.3
LM5
  Top 0.254: C7.- 17.81,73.63 24.1,73.63 C6.1 24.1,73.53 24.1,70.96 30.1,64.96 30.48,64.96 31.91,63.53 38.1,63.53 IC2.5
LM7
  Top 0.254: C5.1 IC2.7
N$1  (via drill 0.3)
  Top 0.254: v52.96,17.72 v25.72,17.72
  Bottom 0.254: IC3.2 15.24,5.43 21.81,12 21.81,13.81 v25.72,17.72 | v52.96,17.72 53.15,17.72 57.82,22.38 63.06,22.38 64.77,24.1 IC5.5
N$3  (via drill 0.3)
  Top 0.254: v51.72,15.72 41.53,15.72 38.58,12.76 38.1,12.76 IC1.12
  Bottom 0.254: v51.72,15.72 68.1,15.72 IC7.8
N$18
  Top 0.254: IC7.12 60.96,12.76 59.82,13.91 59.82,14 42.1,31.72 41.91,31.72 IC6.11
N$19
  Top 0.254: IC3.6 25.43,5.14 25.81,5.14 31.62,10.95 38.86,10.95 40.58,12.67 IC1.11
N$20
  Bottom 0.254: IC7.5 66.01,5.14 65.82,5.14 58.48,12.48 58.48,12.67 IC7.13 58.39,12.48 56.2,10.29 33.24,10.29 30.86,12.67 28,12.67 IC3.8
N$22
  Bottom 0.254: IC7.6 68.58,8 86.3,25.72 86.3,30.48 IC8.11
N$24
  Bottom 0.254: IC5.6 67.34,24.1 67.72,24.1 69.44,22.38 70.29,22.38 76.96,29.05 76.96,30.86 78.11,32 79.92,32 84.58,36.67 84.58,60.48 86.3,62.2 IC9.1
N$45
  Top 0.254: R6.2 16.57,63.53 19.05,63.53 24.1,68.58 C6.2
N$46
  Top 0.254: C8.2 19.05,80.2 29.43,69.82 29.43,67.15 30.48,66.1 IC2.3
N$47
  Top 0.254: C9.2 34.29,81.25 36.77,78.77 R9.2
N$49
  Top 0.254: R8.1 12.67,86.39 8.95,86.39 R4.2
N$50
  Top 0.254: R4.3 8.1,83.82 10.57,81.34 13.91,81.34 C8.1
OUT0
  Top 0.254: IC8.19 86.39,50.77 91.44,50.77 JP3.3 91.53,50.86 93.92,50.86 JP3.4
OUT1
  Top 0.254: IC8.18 86.39,48.29 91.44,48.29 JP3.5 91.53,48.29 93.92,48.29 JP3.6
OUT2
  Top 0.254: IC8.17 JP3.7 JP3.8
OUT3
  Top 0.254: IC8.16 86.39,43.15 91.44,43.15 JP3.9 91.53,43.24 93.92,43.24 JP3.10
OUT4
  Top 0.254: IC8.15 86.39,40.67 91.44,40.67 JP3.11 91.53,40.67 93.92,40.67 JP3.12
OUT5
  Top 0.254: IC8.14 JP3.13 JP3.14
OUT6
  Top 0.254: IC8.13 86.39,35.53 91.44,35.53 JP3.15 91.53,35.62 93.92,35.62 JP3.16
OUT7
  Top 0.254: IC8.12 86.39,33.05 91.44,33.05 JP3.17 91.53,33.05 93.92,33.05 JP3.18
SCLK
  Top 0.254: IC4.14 52.1,58.48 52.1,71.06 63.53,82.49 JP6.2
SET
  Bottom 0.254: IC3.10 22.86,12.76 23.34,12.76 31.43,20.86 49.15,20.86 58.29,30 65.53,30 67.25,31.72 IC5.9
SND0
  Top 0.254: IC6.19 21.62,31.81 21.62,35.53 JP4.2 21.62,35.62 38.96,52.96 49.53,52.96 51.63,50.86 52.01,50.86 IC4.3
SND1
  Top 0.254: IC6.18 24.19,31.81 24.19,35.53 JP4.3 24.1,35.62 41.05,52.58 47.34,52.58 49.05,50.86 49.53,50.86 IC4.2
SND2
  Top 0.254: IC6.17 JP4.4 26.67,35.62 41.81,50.77 46.96,50.77 IC4.1
SND3
  Top 0.254: IC6.16 29.24,31.81 29.24,35.53 JP4.5
  Bottom 0.254: IC4.15 49.53,57.24 29.24,36.96 29.24,35.62 JP4.5
SND4
  Top 0.254: IC6.15 31.81,31.81 31.81,35.53 JP4.6
  Bottom 0.254: IC4.13 54.58,58.39 54.2,58.39 50.2,54.39 47.24,54.39 31.81,38.96 31.81,35.62 JP4.6
SND5
  Top 0.254: JP4.7 IC6.14
  Bottom 0.254: JP4.7 34.29,40.86 47.43,54.01 52.39,54.01 56.77,58.39 57.15,58.39 IC4.12
SND6  (via drill 0.3)
  Top 0.254: IC6.13 36.86,31.81 36.86,35.53 JP4.8 | v59.63,55.44 59.63,58.39 IC4.11
  Bottom 0.254: v59.63,55.44 59.44,55.44 57.24,53.24 49.82,53.24 48.01,51.44 48.01,44.29 40.58,36.86 40.58,30.77 39.81,30 38.58,30 IC6.13
SND7
  Top 0.254: IC6.12 39.43,31.81 39.43,35.53 JP4.9
  Bottom 0.254: IC4.10 62.2,58.39 61.82,58.39 57.05,53.63 47.62,53.63 39.43,45.43 39.43,35.62 JP4.9
VCC  (via drill 0.3)
  Top 0.457: C3.1 53.34,30.48 IC5.14 | 69.72,10.38 58.2,10.38 IC7.14 | 69.72,10.38 71.15,10.38 73.44,12.67 76.2,12.67 V1.16 | 69.72,10.38 69.72,13.91 61.05,22.57 61.05,25.15 54.67,31.53 IC5.14 | 78.06,61.58 78.68,62.2 IC9.20 | 78.06,61.58 76.87,60.39 75.63,60.39 C2.1 | JP2.20 93.92,62.29 91.44,62.29 JP2.19 JP3.1 | JP3.1 IC8.20 86.2,53.44 78.06,61.58 | JP3.1 JP3.2 | JP4.1 IC6.20 | v15.24,23.62 12,20.38 8.95,20.38 JP1.2 | IC5.14 54.77,31.91 54.77,48.67 55.72,49.62 55.72,52.01 51.63,56.1 49.34,56.1 47.05,58.39 IC4.16
  Bottom 0.457: IC1.14 33.05,12.67 33.24,12.67 35.05,10.86 51.44,10.86 52.01,11.43 C4.1 52.29,11.53 53.44,12.67 55.82,12.67 IC7.14 | IC3.14 12.67,12.76 12.67,16.57 8.95,20.29 JP1.2 | IC2.6 38.1,66.01 31.81,59.72 30.48,59.72 C1.1 30.39,59.53 19.05,48.2 JP4.1 | IC2.6 38.1,65.72 45.34,58.48 46.96,58.48 IC4.16 48.86,60.29 75.53,60.29 C2.1 | QG2.8 44.39,82.49 44.39,76.49 39.24,71.34 39.24,67.25 38.2,66.2 IC2.6 | v15.24,23.62 15.24,26.86 17.14,28.77 17.14,30 18.86,31.72 19.05,31.72 IC6.20
WR
  Top 0.254: IC5.11 62.29,31.81 64.77,31.81 IC5.10